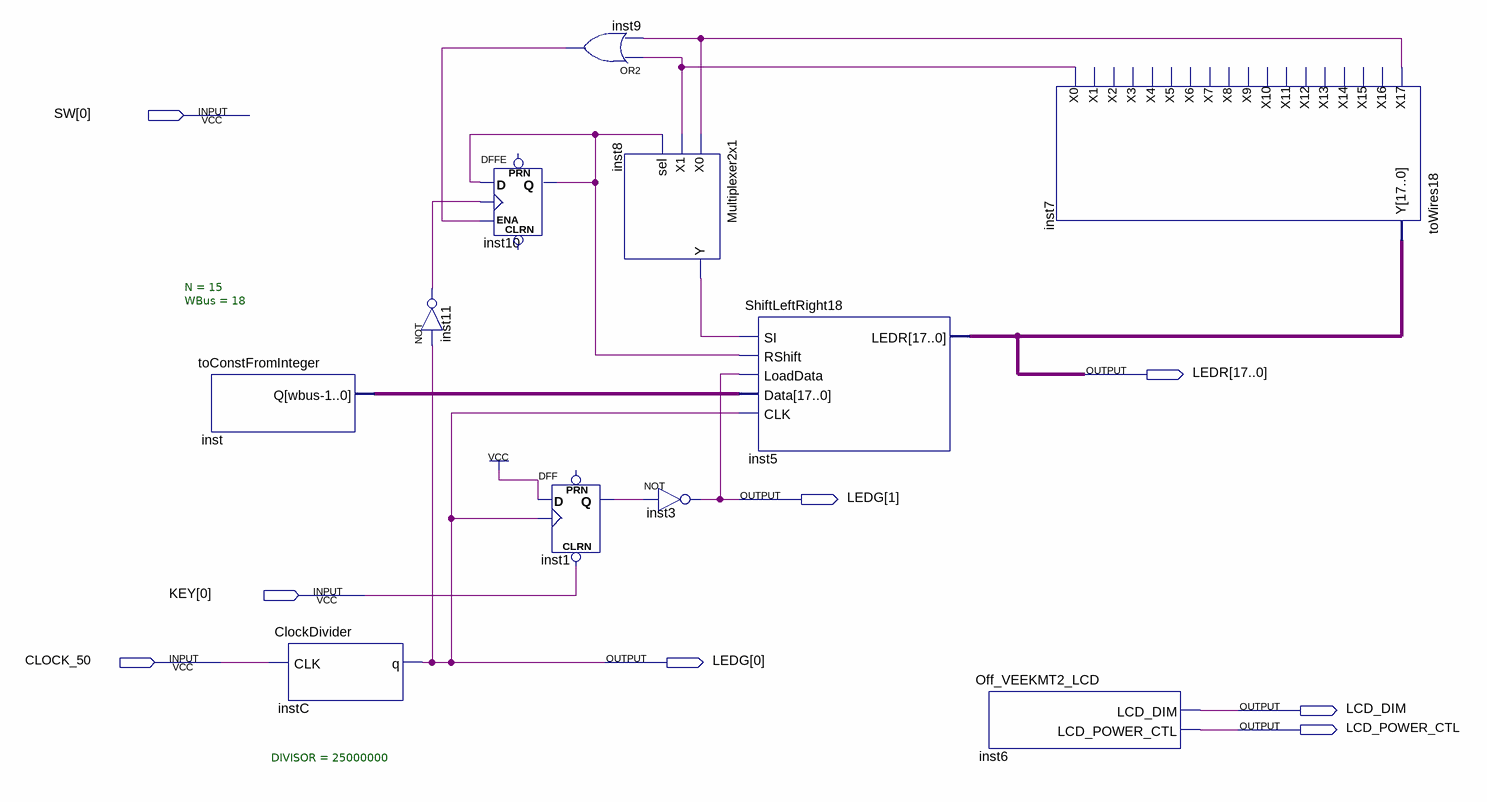
[diagram p0: schematic sheet]
// Quartus schematic majorita3n.bdf as structural Verilog: 11 symbols, 8 pins
module majorita3n (
  input  [0:0] SW,
  input  [0:0] KEY,
  input  CLOCK_50,
  output [17:0] LEDR,
  output [1:0] LEDG,
  output LCD_DIM,
  output LCD_POWER_CTL
);

  wire inst1_q, inst7_x0, inst7_x17, inst8_y, inst9_out, inst10_q, inst11_out;
  wire [17:0] inst_q;

  toConstFromInteger #(.N(15), .WBus(18)) inst (.Q(inst_q));
  ClockDivider #(.DIVISOR(25000000)) instC (.CLK(CLOCK_50), .q(LEDG[0]));
  not inst11 (inst11_out, LEDG[0]);
  DFFE inst10 (.D(inst10_q), .CLK(inst11_out), .ENA(inst9_out), .Q(inst10_q));  // open: PRN, CLRN
  or inst9 (inst9_out, inst7_x0, inst7_x17);
  DFF inst1 (.CLRN(KEY[0]), .CLK(LEDG[0]), .D(1'b1), .Q(inst1_q));  // open: PRN
  Multiplexer2x1 inst8 (.X0(inst7_x17), .X1(inst7_x0), .sel(inst10_q), .Y(inst8_y));
  not inst3 (LEDG[1], inst1_q);
  ShiftLeftRight18 inst5 (
    .SI(inst8_y), .RShift(inst10_q), .LoadData(LEDG[1]), .Data(inst_q), .CLK(LEDG[0]), .LEDR(LEDR));
  Off_VEEKMT2_LCD inst6 (.LCD_DIM(LCD_DIM), .LCD_POWER_CTL(LCD_POWER_CTL));
  toWires18 inst7 (
    .Y(LEDR), .X17(inst7_x17), .X0(inst7_x0));  // open: X16, X15, X14, X13, X12, X11, X10, X9, X8, X7, X6, X5, X4, X3, X2, X1
endmodule
